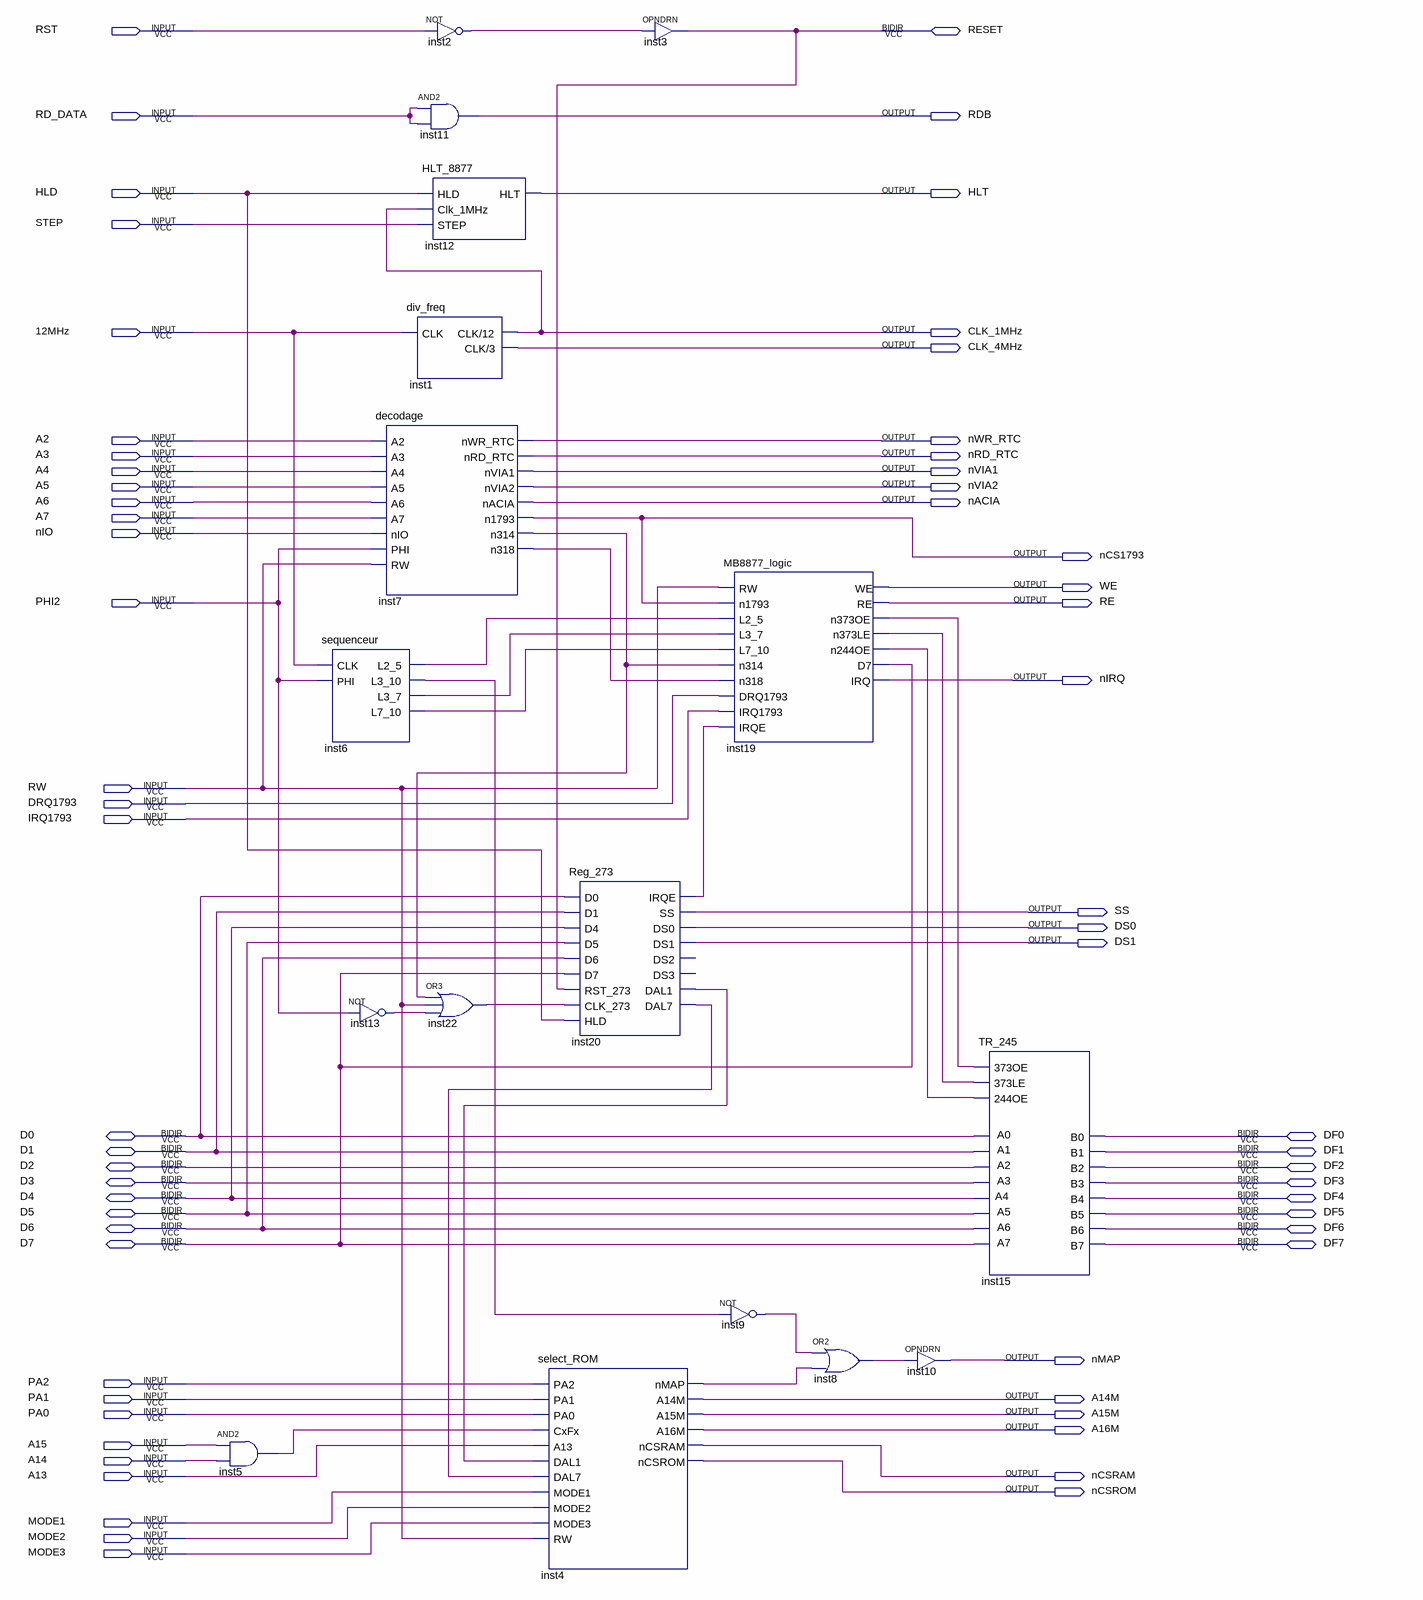
[diagram p0: schematic sheet]
// Quartus schematic CPLD128_Telestrat.bdf as structural Verilog: 17 symbols, 64 pins
module CPLD128_Telestrat (
  input  RST,
  input  RD_DATA,
  input  HLD,
  input  STEP,
  input  \12MHz ,
  input  A2,
  input  A3,
  input  A4,
  input  A5,
  input  A6,
  input  A7,
  input  nIO,
  input  PHI2,
  input  RW,
  input  DRQ1793,
  input  IRQ1793,
  input  PA2,
  input  PA1,
  input  PA0,
  input  A15,
  input  A14,
  input  A13,
  input  MODE1,
  input  MODE2,
  input  MODE3,
  inout  RESET,
  inout  D0,
  inout  DF0,
  inout  D1,
  inout  DF1,
  inout  D2,
  inout  DF2,
  inout  D3,
  inout  DF3,
  inout  D4,
  inout  DF4,
  inout  D5,
  inout  DF5,
  inout  D6,
  inout  DF6,
  inout  D7,
  inout  DF7,
  output RDB,
  output HLT,
  output CLK_1MHz,
  output CLK_4MHz,
  output nWR_RTC,
  output nRD_RTC,
  output nVIA1,
  output nVIA2,
  output nACIA,
  output nCS1793,
  output WE,
  output RE,
  output nIRQ,
  output SS,
  output DS0,
  output DS1,
  output nMAP,
  output A14M,
  output A15M,
  output A16M,
  output nCSRAM,
  output nCSROM
);

  wire inst2_out, inst4_nmap, inst5_out, inst6_l2_5, inst6_l3_7, inst6_l3_10, inst6_l7_10, inst7_n314,
       inst7_n318, inst8_out, inst9_out, inst13_out, inst19_n244oe, inst19_n373le, inst19_n373oe,
       inst20_dal1, inst20_dal7, inst20_irqe, inst22_out;

  and inst5 (inst5_out, A15, A14);
  sequenceur inst6 (
    .CLK(\12MHz ), .PHI(PHI2), .L2_5(inst6_l2_5), .L3_10(inst6_l3_10), .L3_7(inst6_l3_7), .L7_10(inst6_l7_10));
  not inst13 (inst13_out, PHI2);
  and inst11 (RDB, RD_DATA, RD_DATA);
  HLT_8877 inst12 (.HLD(HLD), .Clk_1MHz(CLK_1MHz), .STEP(STEP), .HLT(HLT));
  div_freq inst1 (.CLK(\12MHz ), .\CLK/12 (CLK_1MHz), .\CLK/3 (CLK_4MHz));
  decodage inst7 (
    .A2(A2), .A3(A3), .A4(A4), .A5(A5), .A6(A6), .A7(A7), .nIO(nIO), .PHI(PHI2), .RW(RW), .nWR_RTC(nWR_RTC),
    .nRD_RTC(nRD_RTC), .nVIA1(nVIA1), .nVIA2(nVIA2), .nACIA(nACIA), .n1793(nCS1793), .n314(inst7_n314),
    .n318(inst7_n318));
  not inst2 (inst2_out, RST);
  or inst22 (inst22_out, inst7_n314, RW, inst13_out);
  select_ROM inst4 (
    .PA2(PA2), .PA1(PA1), .PA0(PA0), .CxFx(inst5_out), .A13(A13), .DAL1(inst20_dal1), .DAL7(inst20_dal7),
    .MODE1(MODE1), .MODE2(MODE2), .MODE3(MODE3), .RW(RW), .nMAP(inst4_nmap), .A14M(A14M), .A15M(A15M),
    .A16M(A16M), .nCSRAM(nCSRAM), .nCSROM(nCSROM));
  Reg_273 inst20 (
    .D0(D0), .D1(D1), .D4(D4), .D5(D5), .D6(D6), .D7(D7), .RST_273(RESET), .CLK_273(inst22_out), .HLD(HLD),
    .IRQE(inst20_irqe), .SS(SS), .DS0(DS0), .DS1(DS1), .DAL1(inst20_dal1), .DAL7(inst20_dal7));  // open: DS2, DS3
  OPNDRN inst3 (.IN(inst2_out), .OUT(RESET));
  MB8877_logic inst19 (
    .RW(RW), .n1793(nCS1793), .L2_5(inst6_l2_5), .L3_7(inst6_l3_7), .L7_10(inst6_l7_10), .n314(inst7_n314),
    .n318(inst7_n318), .DRQ1793(DRQ1793), .IRQ1793(IRQ1793), .IRQE(inst20_irqe), .WE(WE), .RE(RE),
    .n373OE(inst19_n373oe), .n373LE(inst19_n373le), .n244OE(inst19_n244oe), .D7(D7), .IRQ(nIRQ));
  not inst9 (inst9_out, inst6_l3_10);
  or inst8 (inst8_out, inst9_out, inst4_nmap);
  OPNDRN inst10 (.IN(inst8_out), .OUT(nMAP));
  TR_245 inst15 (
    .\373OE (inst19_n373oe), .\373LE (inst19_n373le), .\244OE (inst19_n244oe), .A0(D0), .B0(DF0), .A1(D1),
    .B1(DF1), .A2(D2), .B2(DF2), .A3(D3), .B3(DF3), .A4(D4), .B4(DF4), .A5(D5), .B5(DF5), .A6(D6), .B6(DF6),
    .A7(D7), .B7(DF7));
endmodule
